# EAGLE schematic Edgecutter (EAGLE 7.7.0)

## Sheet 1 of 6
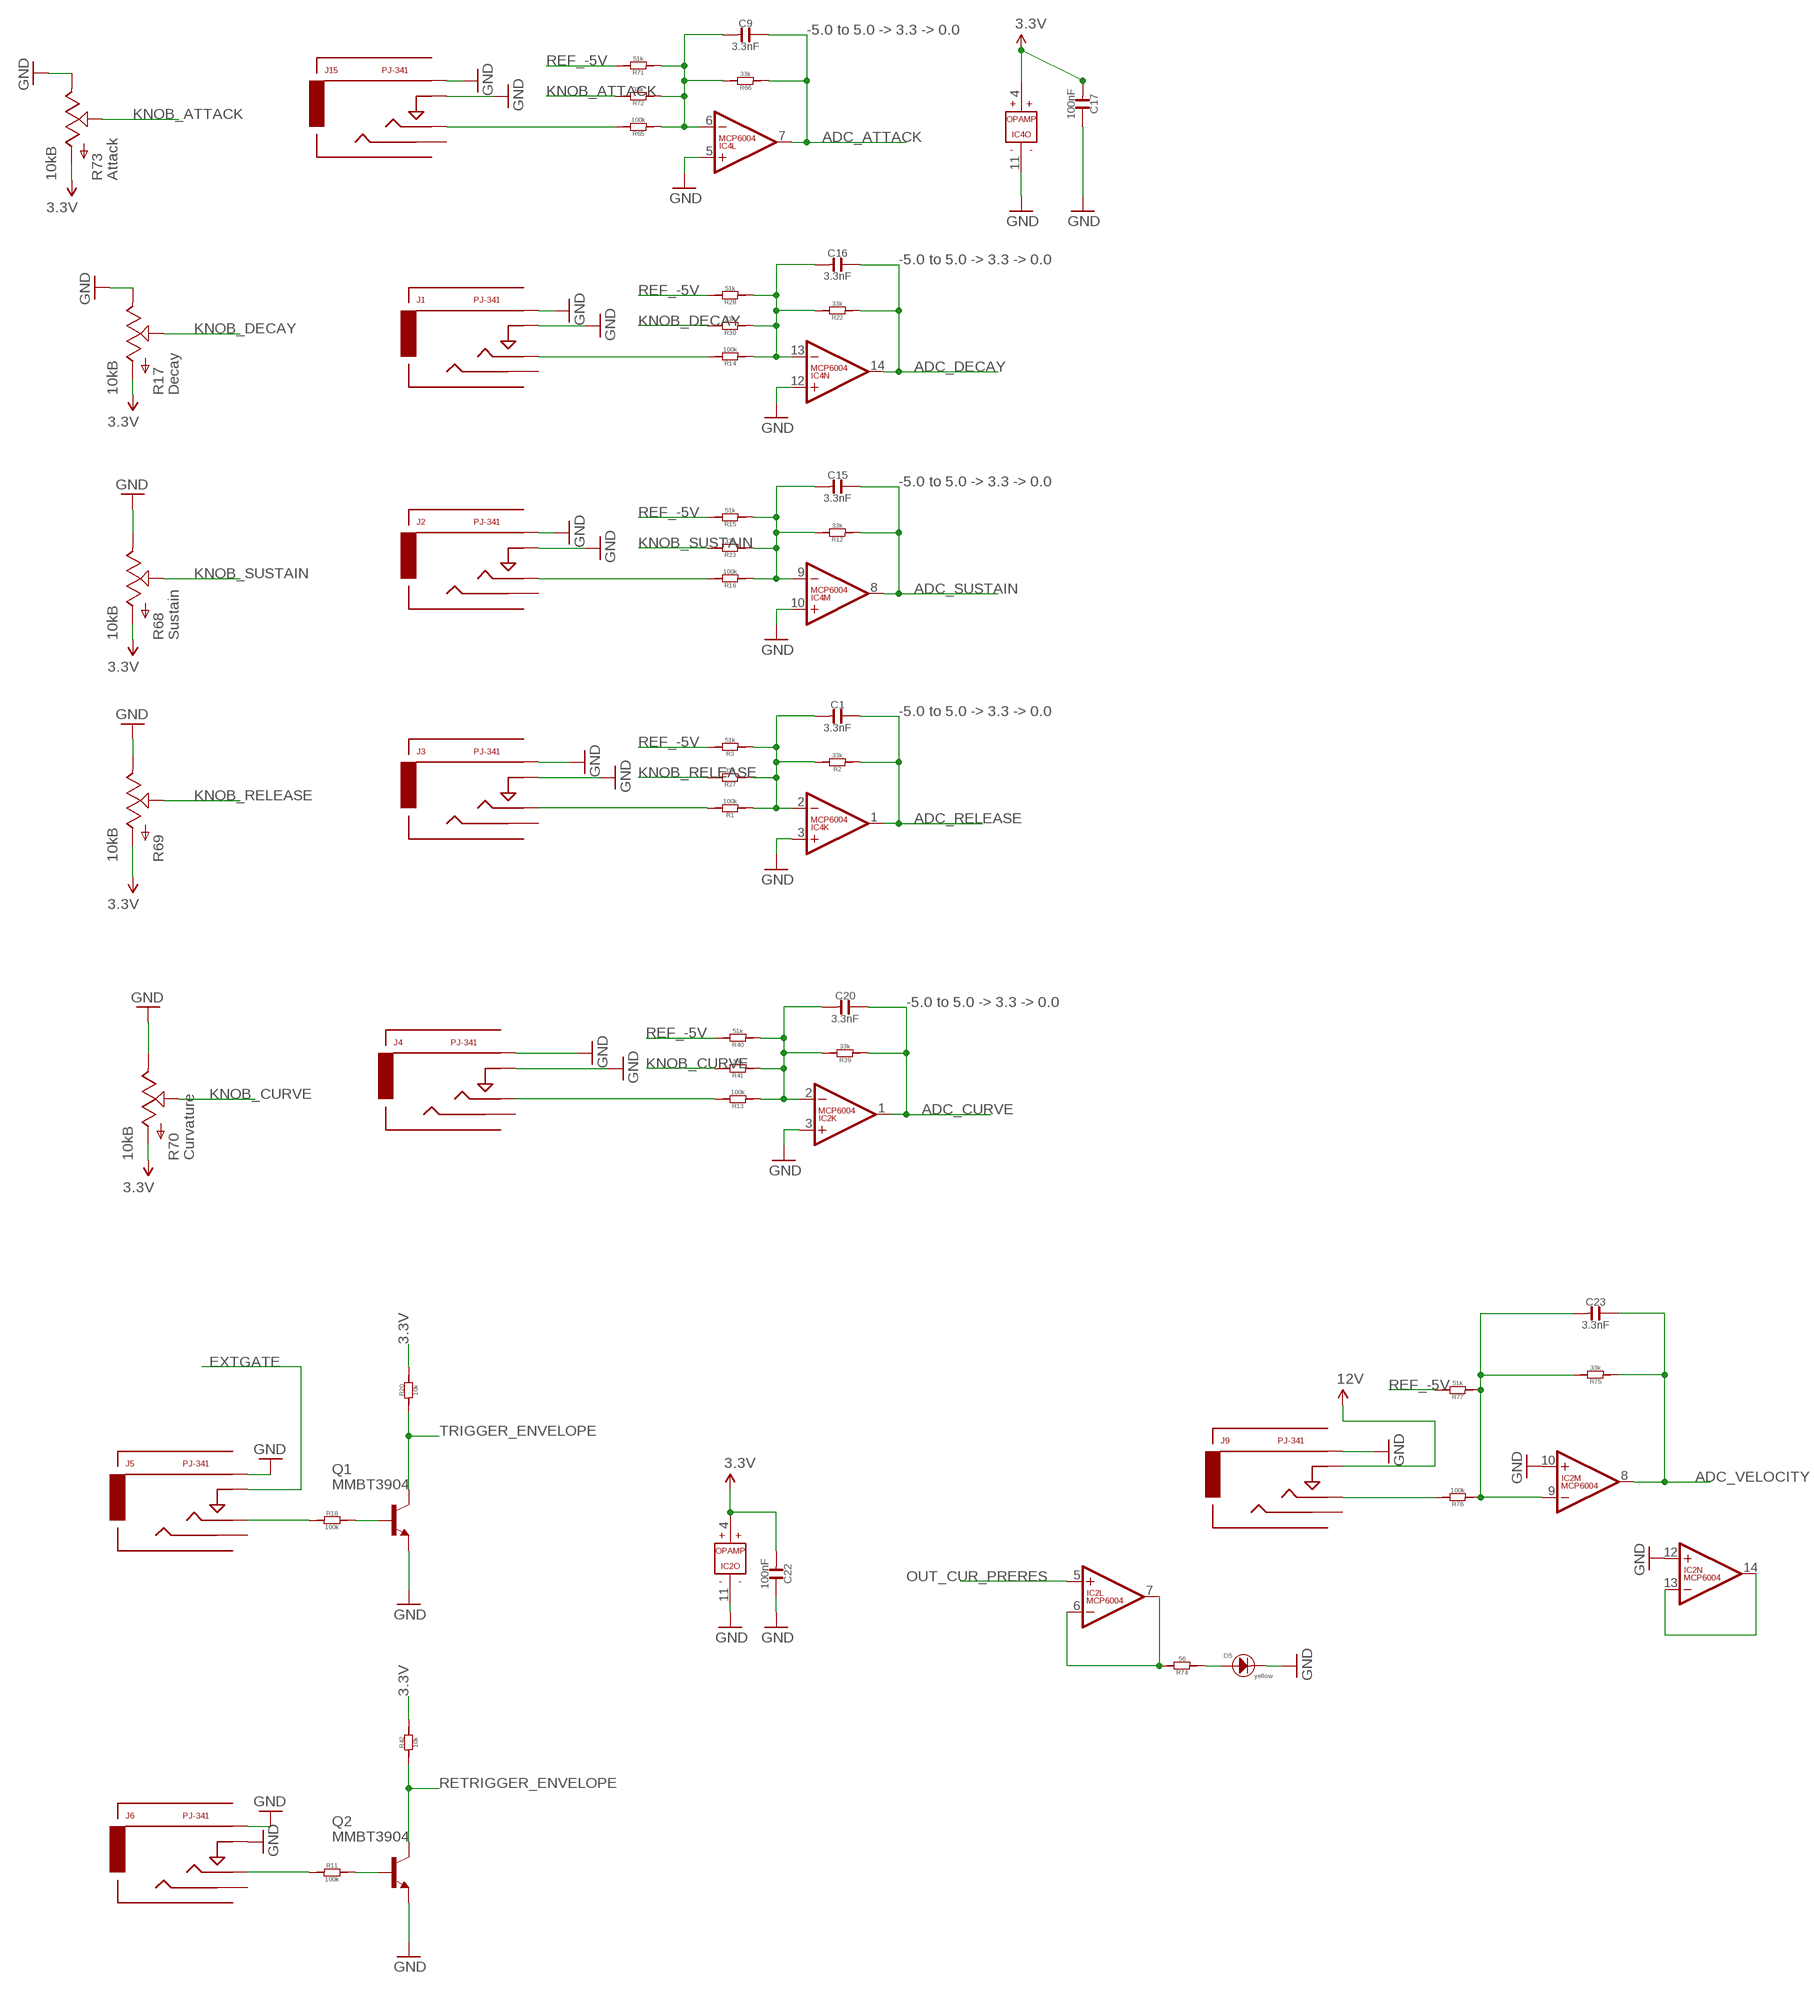
[diagram p0: schematic, sheet 1]

### Parts
C1  3.3nF  C-0603  [C0603]
C9  3.3nF  C-0603  [C0603]
C15  3.3nF  C-0603  [C0603]
C16  3.3nF  C-0603  [C0603]
C17  100nF  C-0603  [C0603]
C20  3.3nF  C-0603  [C0603]
C22  100nF  C-0603  [C0603]
C23  3.3nF  C-0603  [C0603]
D5  yellow  LED3MM  [3MMLED]
IC2  MCP6004  [SO14]
IC4  MCP6004  [SO14]
J1  PJ-341  AUDIO-JACKINPUT  [3.5MM-JACK-SWITCH-13MM-INPUT]
J2  PJ-341  AUDIO-JACKINPUT  [3.5MM-JACK-SWITCH-13MM-INPUT]
J3  PJ-341  AUDIO-JACKINPUT  [3.5MM-JACK-SWITCH-13MM-INPUT]
J4  PJ-341  AUDIO-JACKINPUT  [3.5MM-JACK-SWITCH-13MM-INPUT]
J5  PJ-341  AUDIO-JACKINPUT  [3.5MM-JACK-SWITCH-13MM-INPUT]
J6  PJ-341  AUDIO-JACKINPUT  [3.5MM-JACK-SWITCH-13MM-INPUT]
J9  PJ-341  AUDIO-JACKINPUT  [3.5MM-JACK-SWITCH-13MM-INPUT]
J15  PJ-341  AUDIO-JACKINPUT  [3.5MM-JACK-SWITCH-13MM-INPUT]
Q1  MMBT3904  MMBT3904LT1-NPN-SOT23-BEC  [SOT23-BEC]
Q2  MMBT3904  MMBT3904LT1-NPN-SOT23-BEC  [SOT23-BEC]
R1  100k  R-0603  [R0603]
R2  33k  R-0603  [R0603]
R3  51k  R-0603  [R0603]
R11  100k  R-0603  [R0603]
R12  33k  R-0603  [R0603]
R13  100k  R-0603  [R0603]
R14  100k  R-0603  [R0603]
R15  51k  R-0603  [R0603]
R16  100k  R-0603  [R0603]
R17  10kB  POTZEPHPOT  [OG-POTS_ALPS_POT_VERTICAL]
R18  100k  R-0603  [R0603]
R20  10k  R-0603  [R0603]
R22  33k  R-0603  [R0603]
R23  33k  R-0603  [R0603]
R27  33k  R-0603  [R0603]
R28  51k  R-0603  [R0603]
R30  33k  R-0603  [R0603]
R39  33k  R-0603  [R0603]
R40  51k  R-0603  [R0603]
R41  33k  R-0603  [R0603]
R42  10k  R-0603  [R0603]
R65  100k  R-0603  [R0603]
R66  33k  R-0603  [R0603]
R68  10kB  POTZEPHPOT  [OG-POTS_ALPS_POT_VERTICAL]
R69  10kB  POTZEPHPOT  [OG-POTS_ALPS_POT_VERTICAL]
R70  10kB  POTZEPHPOT  [OG-POTS_ALPS_POT_VERTICAL]
R71  51k  R-0603  [R0603]
R72  33k  R-0603  [R0603]
R73  10kB  POTZEPHPOT  [OG-POTS_ALPS_POT_VERTICAL]
R74  56  R-0603  [R0603]
R75  33k  R-0603  [R0603]
R76  100k  R-0603  [R0603]
R77  51k  R-0603  [R0603]

### Nets
3.3V [mediumpower]: C17.1 C22.1 IC2.4(O:V+) IC4.4(O:V+) R17.P$3(A) R20.2 R42.2 R68.P$3(A) R69.P$3(A) R70.P$3(A) R73.P$3(A) ; also sheet 2,3,4,5,6
12V [heavypower]: J9.SWITCH@3(SWITCH) ; also sheet 3,4,5
ADC_ATTACK: C9.2 IC4.7(L:OUT) R66.1 ; also sheet 6
ADC_CURVE: C20.2 IC2.1(K:OUT) R39.1 ; also sheet 6
ADC_DECAY: C16.2 IC4.14(N:OUT) R22.1 ; also sheet 6
ADC_RELEASE: C1.2 IC4.1(K:OUT) R2.1 ; also sheet 6
ADC_SUSTAIN: C15.2 IC4.8(M:OUT) R12.1 ; also sheet 6
ADC_VELOCITY: C23.2 IC2.8(M:OUT) R75.1 ; also sheet 6
EXTGATE: J5.SWITCH@3(SWITCH) ; also sheet 3
GND [groundplane]: C17.2 C22.2 D5.- IC2.3(K:+IN) IC2.10(M:+IN) IC2.11(O:V-) IC2.12(N:+IN) IC4.3(K:+IN) IC4.5(L:+IN) IC4.10(M:+IN) IC4.11(O:V-) IC4.12(N:+IN) J1.RING@3(RING) J1.SWITCH@3(SWITCH) J2.RING@3(RING) J2.SWITCH@3(SWITCH) J3.RING@3(RING) J3.SWITCH@3(SWITCH) J4.RING@3(RING) J4.SWITCH@3(SWITCH) J5.RING@3(RING) J6.RING@3(RING) J6.SWITCH@3(SWITCH) J9.RING@3(RING) J15.RING@3(RING) J15.SWITCH@3(SWITCH) Q1.E Q2.E R17.P$1(E) R68.P$1(E) R69.P$1(E) R70.P$1(E) R73.P$1(E) ; also sheet 2,3,4,5,6
KNOB_ATTACK: R72.2 R73.P$2(S)
KNOB_CURVE: R41.2 R70.P$2(S)
KNOB_DECAY: R17.P$2(S) R30.2
KNOB_RELEASE: R27.2 R69.P$2(S)
KNOB_SUSTAIN: R23.2 R68.P$2(S)
N$3: J2.TIP@3(TIP) R16.2
N$4: C15.1 IC4.9(M:-IN) R12.2 R15.1 R16.1 R23.1
N$6: J3.TIP@3(TIP) R1.2
N$8: C1.1 IC4.2(K:-IN) R1.1 R2.2 R3.1 R27.1
N$11: J15.TIP@3(TIP) R65.2
N$12: J4.TIP@3(TIP) R13.2
N$15: Q1.B R18.2
N$16: J5.TIP@3(TIP) R18.1
N$19 [groundplane]: IC2.6(L:-IN) IC2.7(L:OUT) R74.2
N$22: C9.1 IC4.6(L:-IN) R65.1 R66.2 R71.1 R72.1
N$26 [groundplane]: IC2.13(N:-IN) IC2.14(N:OUT)
N$33: J1.TIP@3(TIP) R14.2
N$34: C16.1 IC4.13(N:-IN) R14.1 R22.2 R28.1 R30.1
N$43: Q2.B R11.2
N$46: C20.1 IC2.2(K:-IN) R13.1 R39.2 R40.1 R41.1
N$47: J6.TIP@3(TIP) R11.1
N$56: C23.1 IC2.9(M:-IN) R75.2 R76.1 R77.1
N$59: D5.+ R74.1
N$61: J9.TIP@3(TIP) R76.2
OUT_CUR_PRERES: IC2.5(L:+IN) ; also sheet 4
REF_-5V: R3.2 R15.2 R28.2 R40.2 R71.2 R77.2 ; also sheet 3
RETRIGGER_ENVELOPE: Q2.C R42.1 ; also sheet 6
TRIGGER_ENVELOPE: Q1.C R20.1 ; also sheet 6
Unconnected: J1.SECOND@3(SECOND) J2.SECOND@3(SECOND) J3.SECOND@3(SECOND) J4.SECOND@3(SECOND) J5.SECOND@3(SECOND) J6.SECOND@3(SECOND) J9.SECOND@3(SECOND) J15.SECOND@3(SECOND)

### Notes on the sheet
- -5.0 to 5.0 -> 3.3 -> 0.0
- -5.0 to 5.0 -> 3.3 -> 0.0
- -5.0 to 5.0 -> 3.3 -> 0.0
- -5.0 to 5.0 -> 3.3 -> 0.0
- -5.0 to 5.0 -> 3.3 -> 0.0

## Sheet 2 of 6: LEDS and Buttons
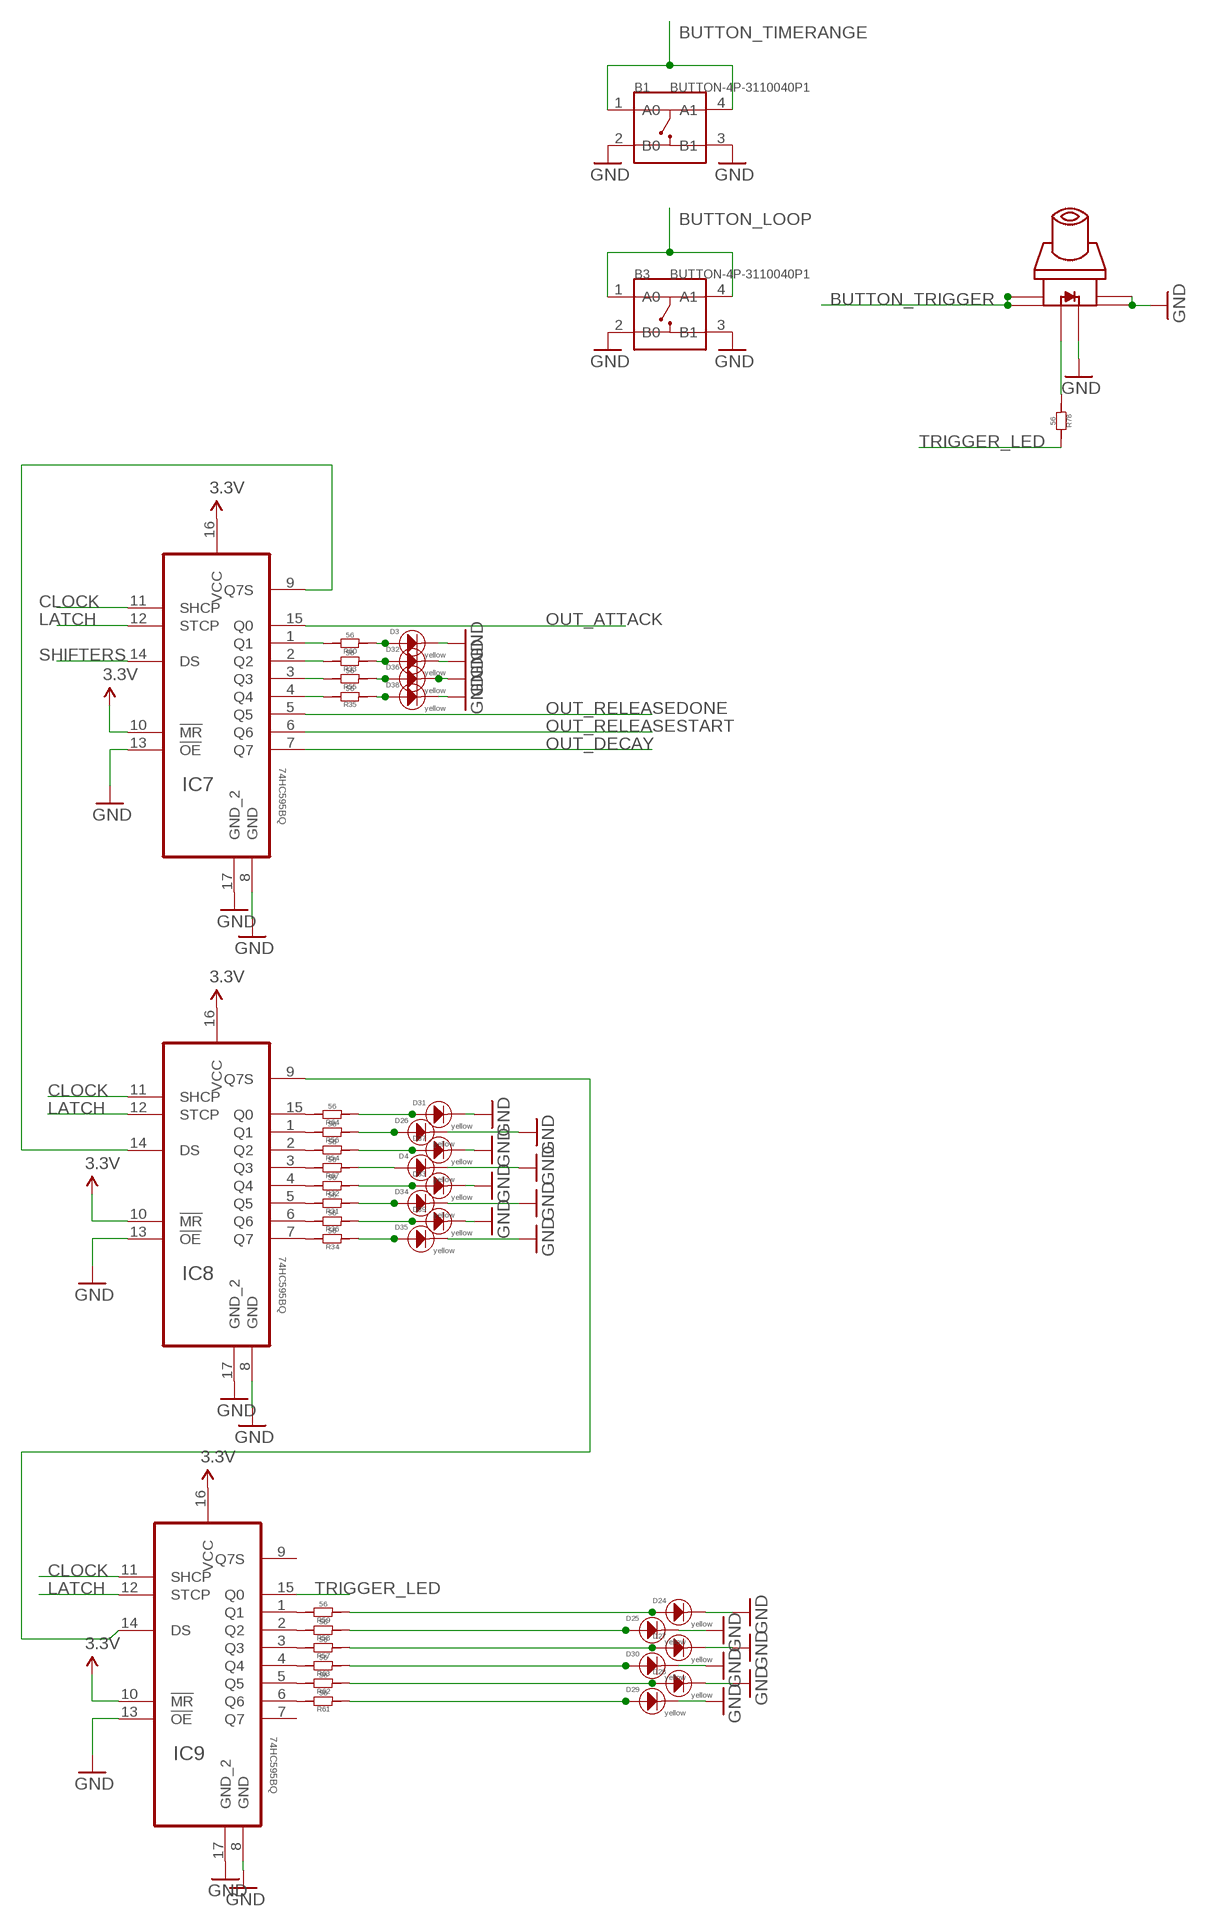
[diagram p1: schematic, sheet 2]

### Parts
B1  BUTTON-4P-3110040P1  [4P-6.0X6.0X5.0H]
B3  BUTTON-4P-3110040P1  [4P-6.0X6.0X5.0H]
D3  yellow  LED3MM  [3MMLED]
D4  yellow  LED3MM  [3MMLED]
D24  yellow  LED3MM  [3MMLED]
D25  yellow  LED3MM  [3MMLED]
D26  yellow  LED3MM  [3MMLED]
D27  yellow  LED3MM  [3MMLED]
D28  yellow  LED3MM  [3MMLED]
D29  yellow  LED3MM  [3MMLED]
D30  yellow  LED3MM  [3MMLED]
D31  yellow  LED3MM  [3MMLED]
D32  yellow  LED3MM  [3MMLED]
D33  yellow  LED3MM  [3MMLED]
D34  yellow  LED3MM  [3MMLED]
D35  yellow  LED3MM  [3MMLED]
D36  yellow  LED3MM  [3MMLED]
D37  yellow  LED3MM  [3MMLED]
D38  yellow  LED3MM  [3MMLED]
D39  yellow  LED3MM  [3MMLED]
IC7  74HC595BQ  [QFN50P250X350X100-17N]
IC8  74HC595BQ  [QFN50P250X350X100-17N]
IC9  74HC595BQ  [QFN50P250X350X100-17N]
R31  56  R-0603  [R0603]
R32  56  R-0603  [R0603]
R33  56  R-0603  [R0603]
R34  56  R-0603  [R0603]
R35  56  R-0603  [R0603]
R36  56  R-0603  [R0603]
R54  56  R-0603  [R0603]
R55  56  R-0603  [R0603]
R56  56  R-0603  [R0603]
R57  56  R-0603  [R0603]
R58  56  R-0603  [R0603]
R59  56  R-0603  [R0603]
R60  56  R-0603  [R0603]
R61  56  R-0603  [R0603]
R62  56  R-0603  [R0603]
R63  56  R-0603  [R0603]
R64  56  R-0603  [R0603]
R67  56  R-0603  [R0603]
R78  56  R-0603  [R0603]
U$2  SWITCH_W_LED_PB6149L-X-102YELLOW  [PB6149L]

### Nets
3.3V [mediumpower]: IC7.10(!MR) IC7.16(VCC) IC8.10(!MR) IC8.16(VCC) IC9.10(!MR) IC9.16(VCC) ; also sheet 1,3,4,5,6
BUTTON_LOOP: B3.1(A0) B3.4(A1) ; also sheet 6
BUTTON_TIMERANGE: B1.1(A0) B1.4(A1) ; also sheet 6
BUTTON_TRIGGER: U$2.1 U$2.2 ; also sheet 6
CLOCK: IC7.11(SHCP) IC8.11(SHCP) IC9.11(SHCP) ; also sheet 6
GND [groundplane]: B1.2(B0) B1.3(B1) B3.2(B0) B3.3(B1) D3.- D4.- D24.- D25.- D26.- D27.- D28.- D29.- D30.- D31.- D32.- D33.- D34.- D35.- D36.- D37.- D38.- D39.- IC7.8(GND) IC7.13(!OE) IC7.17(GND_2) IC8.8(GND) IC8.13(!OE) IC8.17(GND_2) IC9.8(GND) IC9.13(!OE) IC9.17(GND_2) U$2.3 U$2.4 U$2.LEDNEG(NEG) ; also sheet 1,3,4,5,6
LATCH: IC7.12(STCP) IC8.12(STCP) IC9.12(STCP) ; also sheet 6
N$1: R78.1 U$2.LEDPOS(POS)
N$14: IC8.7(Q7) R34.2
N$27: IC8.15(Q0) R64.2
N$28: D28.+ R62.1
N$30: D4.+ R67.1
N$31: IC7.1(Q1) R60.2
N$32: D29.+ R61.1
N$35: IC7.2(Q2) R33.2
N$36: IC7.3(Q3) R55.2
N$37: IC7.4(Q4) R35.2
N$38: IC8.1(Q1) R56.2
N$39: IC8.2(Q2) R54.2
N$40: IC8.3(Q3) R67.2
N$41: IC8.4(Q4) R32.2
N$42: IC8.5(Q5) R31.2
N$48: IC8.6(Q6) R36.2
N$49: IC9.1(Q1) R59.2
N$50: IC9.2(Q2) R58.2
N$51: D3.+ R60.1
N$52: IC9.3(Q3) R57.2
N$53: IC9.4(Q4) R63.2
N$54: IC9.5(Q5) R62.2
N$55: IC9.6(Q6) R61.2
N$73: D27.+ R57.1
N$74: D26.+ R56.1
N$75: D25.+ R58.1
N$76: D24.+ R59.1
N$77: D30.+ R63.1
N$78: D31.+ R64.1
N$79: D32.+ R33.1
N$80: D33.+ R32.1
N$81: D34.+ R31.1
N$82: D35.+ R34.1
N$83: D36.+ R55.1
N$84: D37.+ R54.1
N$85: D38.+ R35.1
N$86: D39.+ R36.1
OUT_ATTACK: IC7.15(Q0) ; also sheet 5
OUT_DECAY: IC7.7(Q7) ; also sheet 5
OUT_RELEASEDONE: IC7.5(Q5) ; also sheet 5
OUT_RELEASESTART: IC7.6(Q6) ; also sheet 5
SHIFTER1TO2: IC7.9(Q7S) IC8.14(DS)
SHIFTER2TO3: IC8.9(Q7S) IC9.14(DS)
SHIFTERS: IC7.14(DS) ; also sheet 6
TRIGGER_LED: IC9.15(Q0) R78.2
Unconnected: IC9.7(Q7) IC9.9(Q7S)

## Sheet 3 of 6: Power
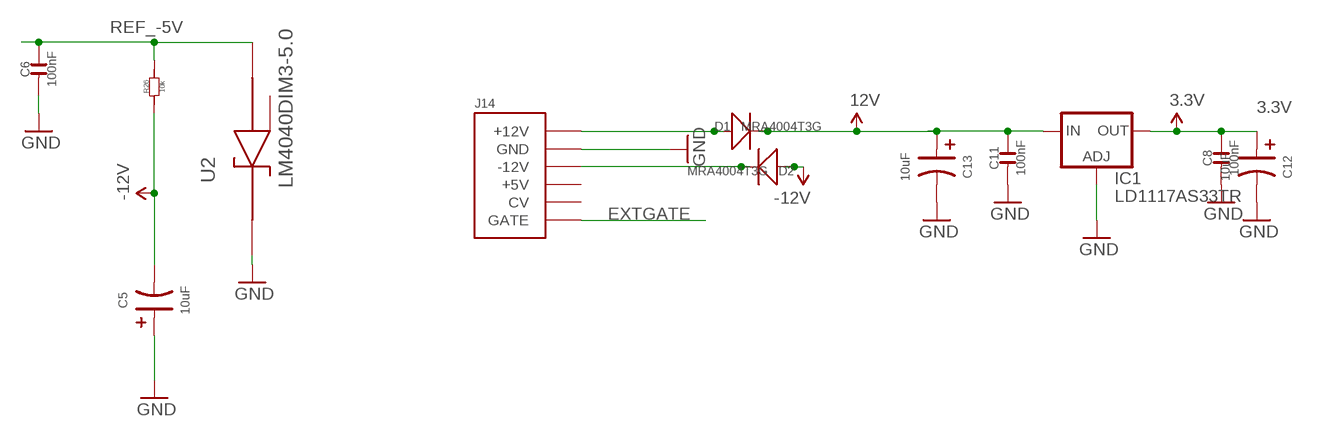
[diagram p2: schematic, sheet 3]

### Parts
C5  10uF  C-POLAR-A  [AVX-A]
C6  100nF  C-0603  [C0603]
C8  100nF  C-0603  [C0603]
C11  100nF  C-0603  [C0603]
C12  10uF  C-POLAR-A  [AVX-A]
C13  10uF  C-POLAR-A  [AVX-A]
D1  MRA4004T3G  D-SMA  [DO-214AC]
D2  MRA4004T3G  D-SMA  [DO-214AC]
IC1  LD1117AS33TR  [SOT223]
J14  POWERSMT  [2X08_SMT_HEADER]
R26  10k  R-0603  [R0603]
U2  LM4040DIM3-5.0  [SOT95P237X112-3N]

### Nets
3.3V [mediumpower]: C8.2 C12.+ IC1.2(OUT) IC1.4(OUT) ; also sheet 1,2,4,5,6
12V [heavypower]: C11.2 C13.+ D1.2(-) IC1.3(IN) ; also sheet 1,4,5
-12V [heavypower]: C5.- D2.1(+) R26.1 ; also sheet 4
EXTGATE: J14.15(GATE) J14.16(GATE) ; also sheet 1
GND [groundplane]: C5.+ C6.1 C8.1 C11.1 C12.- C13.- IC1.1(ADJ) J14.3(GND) J14.4(GND) J14.5(GND) J14.6(GND) J14.7(GND) J14.8(GND) U2.1(CATHODE) ; also sheet 1,2,4,5,6
N$13 [heavypower]: D1.1(+) J14.9(+12V) J14.10(+12V)
N$64 [heavypower]: D2.2(-) J14.1(-12V) J14.2(-12V)
REF_-5V: C6.2 R26.2 U2.2(ANODE) ; also sheet 1
Unconnected: J14.11(+5V) J14.12(+5V) J14.13(CV) J14.14(CV) U2.3(NC)

## Sheet 4 of 6: DAC Output
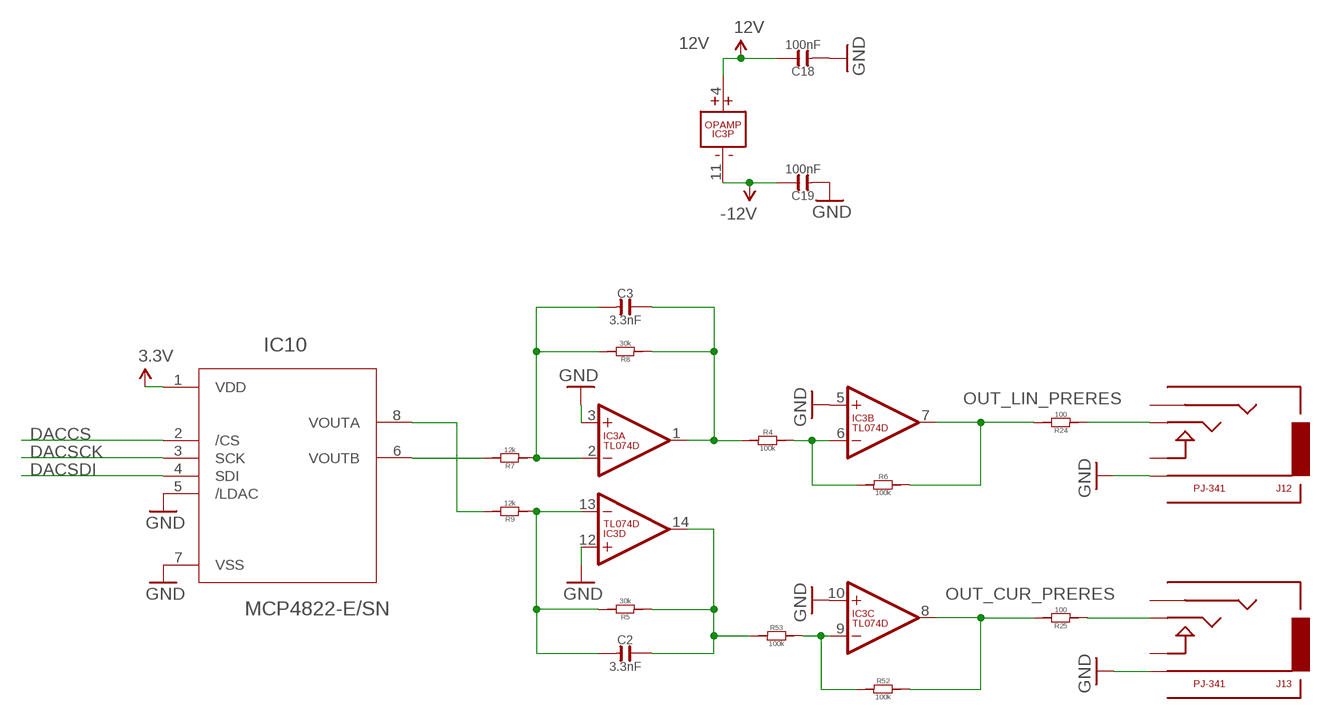
[diagram p3: schematic, sheet 4]

### Parts
C2  3.3nF  C-0603  [C0603]
C3  3.3nF  C-0603  [C0603]
C18  100nF  C-0603  [C0603]
C19  100nF  C-0603  [C0603]
IC3  TL074D  [SO14]
IC10  MCP4822-E/SN  [SOIC8-N_MC]
J12  PJ-341  AUDIO-JACKOUTPUT  [3.5MM-JACK-SWITCH-13MM-OUTPUT]
J13  PJ-341  AUDIO-JACKOUTPUT  [3.5MM-JACK-SWITCH-13MM-OUTPUT]
R4  100k  R-0603  [R0603]
R5  30k  R-0603  [R0603]
R6  100k  R-0603  [R0603]
R7  12k  R-0603  [R0603]
R8  30k  R-0603  [R0603]
R9  12k  R-0603  [R0603]
R24  100  R-0603  [R0603]
R25  100  R-0603  [R0603]
R52  100k  R-0603  [R0603]
R53  100k  R-0603  [R0603]

### Nets
3.3V [mediumpower]: IC10.1(VDD) ; also sheet 1,2,3,5,6
12V [heavypower]: C18.2 IC3.4(P:V+) ; also sheet 1,3,5
-12V [heavypower]: C19.2 IC3.11(P:V-) ; also sheet 3
DACCS: IC10.2(/CS) ; also sheet 6
DACSCK: IC10.3(SCK) ; also sheet 6
DACSDI: IC10.4(SDI) ; also sheet 6
GND [groundplane]: C18.1 C19.1 IC3.3(A:+IN) IC3.5(B:+IN) IC3.10(C:+IN) IC3.12(D:+IN) IC10.5(/LDAC) IC10.7(VSS) J12.RING@3(RING) J13.RING@3(RING) ; also sheet 1,2,3,5,6
N$2: IC3.6(B:-IN) R4.2 R6.1
N$5: IC10.8(VOUTA) R9.2
N$7: IC10.6(VOUTB) R7.2
N$9: C2.1 IC3.13(D:-IN) R5.2 R9.1
N$10: C3.1 IC3.2(A:-IN) R7.1 R8.2
N$17: IC3.9(C:-IN) R52.1 R53.2
N$18: C3.2 IC3.1(A:OUT) R4.1 R8.1
N$20: J13.TIP@3(TIP) R25.1
N$21: J12.TIP@3(TIP) R24.1
N$24: C2.2 IC3.14(D:OUT) R5.1 R53.1
OUT_CUR_PRERES: IC3.8(C:OUT) R25.2 R52.2 ; also sheet 1
OUT_LIN_PRERES: IC3.7(B:OUT) R6.2 R24.2
Unconnected: J12.SECOND@3(SECOND) J12.SWITCH@3(SWITCH) J13.SECOND@3(SECOND) J13.SWITCH@3(SWITCH)

## Sheet 5 of 6: State Outputs
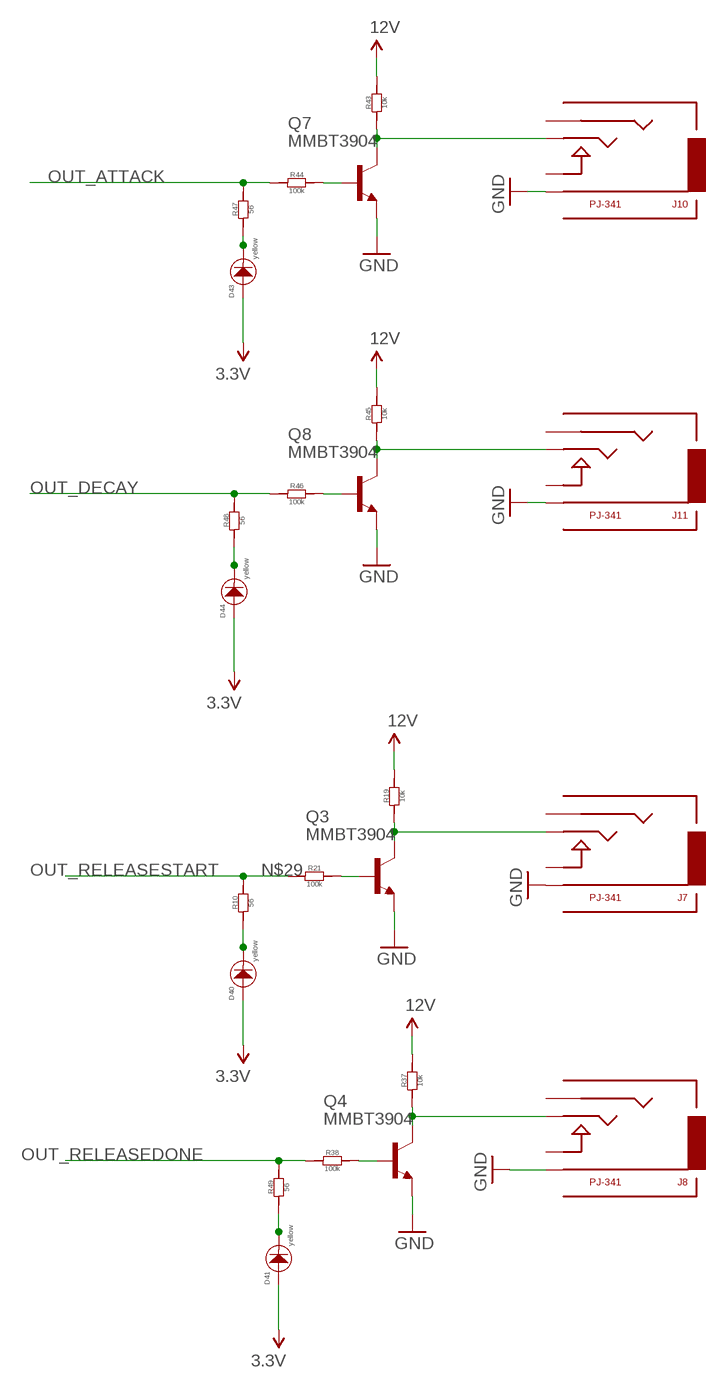
[diagram p4: schematic, sheet 5]

### Parts
D40  yellow  LED3MM  [3MMLED]
D41  yellow  LED3MM  [3MMLED]
D43  yellow  LED3MM  [3MMLED]
D44  yellow  LED3MM  [3MMLED]
J7  PJ-341  AUDIO-JACKOUTPUT  [3.5MM-JACK-SWITCH-13MM-OUTPUT]
J8  PJ-341  AUDIO-JACKOUTPUT  [3.5MM-JACK-SWITCH-13MM-OUTPUT]
J10  PJ-341  AUDIO-JACKOUTPUT  [3.5MM-JACK-SWITCH-13MM-OUTPUT]
J11  PJ-341  AUDIO-JACKOUTPUT  [3.5MM-JACK-SWITCH-13MM-OUTPUT]
Q3  MMBT3904  MMBT3904LT1-NPN-SOT23-BEC  [SOT23-BEC]
Q4  MMBT3904  MMBT3904LT1-NPN-SOT23-BEC  [SOT23-BEC]
Q7  MMBT3904  MMBT3904LT1-NPN-SOT23-BEC  [SOT23-BEC]
Q8  MMBT3904  MMBT3904LT1-NPN-SOT23-BEC  [SOT23-BEC]
R10  56  R-0603  [R0603]
R19  10k  R-0603  [R0603]
R21  100k  R-0603  [R0603]
R37  10k  R-0603  [R0603]
R38  100k  R-0603  [R0603]
R43  10k  R-0603  [R0603]
R44  100k  R-0603  [R0603]
R45  10k  R-0603  [R0603]
R46  100k  R-0603  [R0603]
R47  56  R-0603  [R0603]
R48  56  R-0603  [R0603]
R49  56  R-0603  [R0603]

### Nets
3.3V [mediumpower]: D40.+ D41.+ D43.+ D44.+ ; also sheet 1,2,3,4,6
12V [heavypower]: R19.2 R37.2 R43.2 R45.2 ; also sheet 1,3,4
D21: D43.- R47.1
GND [groundplane]: J7.RING@3(RING) J8.RING@3(RING) J10.RING@3(RING) J11.RING@3(RING) Q3.E Q4.E Q7.E Q8.E ; also sheet 1,2,3,4,6
N$23: D40.- R10.1
N$25: Q3.B R21.2
N$29: J7.TIP@3(TIP) Q3.C R19.1
N$44: D41.- R49.1
N$45: D44.- R48.1
N$57: Q4.B R38.2
N$58: J8.TIP@3(TIP) Q4.C R37.1
N$68: Q7.B R44.2
N$69: J10.TIP@3(TIP) Q7.C R43.1
N$71: Q8.B R46.2
N$72: J11.TIP@3(TIP) Q8.C R45.1
OUT_ATTACK: R44.1 R47.2 ; also sheet 2
OUT_DECAY: R46.1 R48.2 ; also sheet 2
OUT_RELEASEDONE: R38.1 R49.2 ; also sheet 2
OUT_RELEASESTART: R10.2 R21.1 ; also sheet 2
Unconnected: J7.SECOND@3(SECOND) J7.SWITCH@3(SWITCH) J8.SECOND@3(SECOND) J8.SWITCH@3(SWITCH) J10.SECOND@3(SECOND) J10.SWITCH@3(SWITCH) J11.SECOND@3(SECOND) J11.SWITCH@3(SWITCH)

## Sheet 6 of 6: MCU & Eeprom
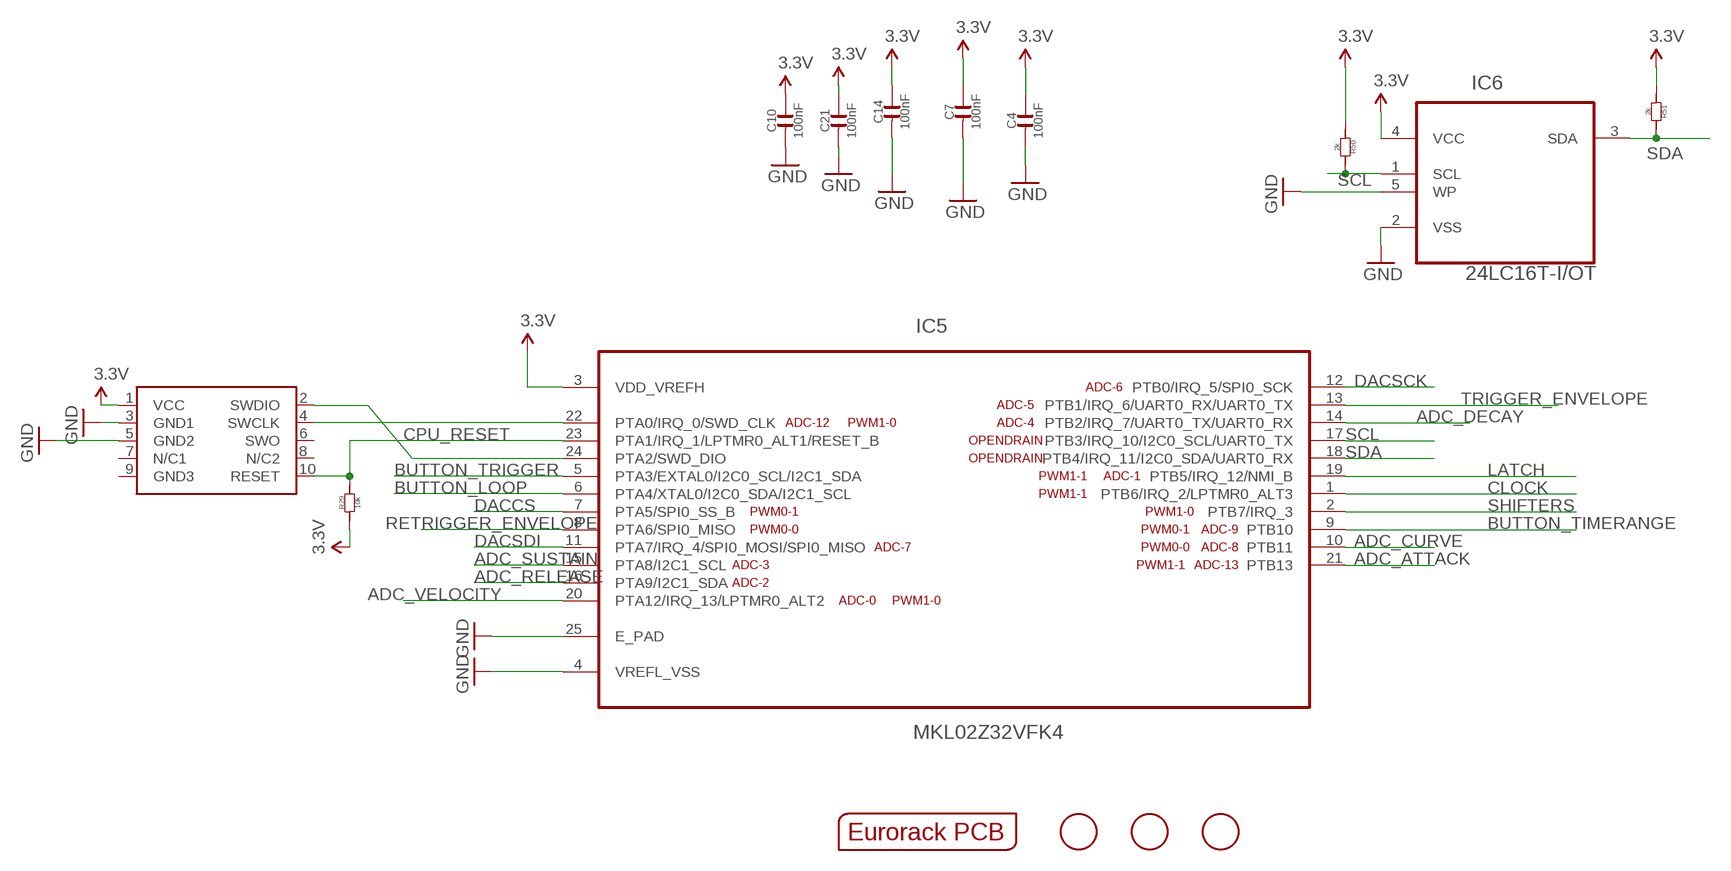
[diagram p5: schematic, sheet 6]

### Parts
C4  100nF  C-0603  [C0603]
C7  100nF  C-0603  [C0603]
C10  100nF  C-0603  [C0603]
C14  100nF  C-0603  [C0603]
C21  100nF  C-0603  [C0603]
FID1  FIDUCIAL  [FIDUCIAL_1MM]
FID2  FIDUCIAL  [FIDUCIAL_1MM]
FID3  FIDUCIAL  [FIDUCIAL_1MM]
IC5  MKL02Z32VFK4  [QFN50P400X400X100-25N]
IC6  24LC16T-I/OT  24LC00T-I/OT  [SOT95P290X145-5N]
OUTLINE  EURORACK_PCB12HP  [EURORACK12HPPCB]
R29  10k  R-0603  [R0603]
R50  2k  R-0603  [R0603]
R51  2k  R-0603  [R0603]
SWD1  CORTEX_SWD  [M50-3600542]

### Nets
3.3V [mediumpower]: C4.2 C7.2 C10.2 C14.2 C21.2 IC5.3(VDD_VREFH) IC6.4(VCC) R29.1 R50.1 R51.1 SWD1.1(VCC) ; also sheet 1,2,3,4,5
ADC_ATTACK: IC5.21(PTB13) ; also sheet 1
ADC_CURVE: IC5.10(PTB11) ; also sheet 1
ADC_DECAY: IC5.14(PTB2/IRQ_7/UART0_TX/UART0_RX) ; also sheet 1
ADC_RELEASE: IC5.16(PTA9/I2C1_SDA) ; also sheet 1
ADC_SUSTAIN: IC5.15(PTA8/I2C1_SCL) ; also sheet 1
ADC_VELOCITY: IC5.20(PTA12/IRQ_13/LPTMR0_ALT2) ; also sheet 1
BUTTON_LOOP: IC5.6(PTA4/XTAL0/I2C0_SDA/I2C1_SCL) ; also sheet 2
BUTTON_TIMERANGE: IC5.9(PTB10) ; also sheet 2
BUTTON_TRIGGER: IC5.5(PTA3/EXTAL0/I2C0_SCL/I2C1_SDA) ; also sheet 2
CLOCK: IC5.1(PTB6/IRQ_2/LPTMR0_ALT3) ; also sheet 2
CPU_RESET: IC5.23(PTA1/IRQ_1/LPTMR0_ALT1/RESET_B) R29.2 SWD1.10(RESET)
DACCS: IC5.7(PTA5/SPI0_SS_B) ; also sheet 4
DACSCK: IC5.12(PTB0/IRQ_5/SPI0_SCK) ; also sheet 4
DACSDI: IC5.11(PTA7/IRQ_4/SPI0_MOSI/SPI0_MISO) ; also sheet 4
GND [groundplane]: C4.1 C7.1 C10.1 C14.1 C21.1 IC5.4(VREFL_VSS) IC5.25(E_PAD) IC6.2(VSS) IC6.5(WP) SWD1.3(GND1) SWD1.5(GND2) ; also sheet 1,2,3,4,5
LATCH: IC5.19(PTB5/IRQ_12/NMI_B) ; also sheet 2
RETRIGGER_ENVELOPE: IC5.8(PTA6/SPI0_MISO) ; also sheet 1
SCL: IC5.17(PTB3/IRQ_10/I2C0_SCL/UART0_TX) IC6.1(SCL) R50.2
SDA: IC5.18(PTB4/IRQ_11/I2C0_SDA/UART0_RX) IC6.3(SDA) R51.2
SHIFTERS: IC5.2(PTB7/IRQ_3) ; also sheet 2
SWD_CLK: IC5.22(PTA0/IRQ_0/SWD_CLK) SWD1.4(SWCLK)
SWD_DIO: IC5.24(PTA2/SWD_DIO) SWD1.2(SWDIO)
TRIGGER_ENVELOPE: IC5.13(PTB1/IRQ_6/UART0_RX/UART0_TX) ; also sheet 1
Unconnected: SWD1.6(SWO) SWD1.7(N/C1) SWD1.8(N/C2) SWD1.9(GND3)

## Library data of the parts
B1 B3 = zephod-components:BUTTON-4P; OC_FARNELL: unknown
C1-C3 C9 C15 C16 C20 C23 = OPL:C*; OC_FARNELL: unknown
C4 C7 C8 C10 C11 C14 C17-C19 C21 C22 = OPL:C*; MF: MULTICOMP; MPN: MC0603F104Z160CT; OC_FARNELL: 1759017
C5 C12 C13 = EurorackModularParts:C-POLAR*; MF: AVX; MPN: TAJB106K020RNJ; OC_FARNELL: 197427
C6 = OPL:C*; MF: AVX; MPN: 06035C104KAT2A; OC_FARNELL: 1301804
D1 D2 = OPL:D*: DIODE; MF: VISHAY; MPN: US1G-E3/5AT; OC_FARNELL: 9551824
D3-D5 D24-D41 D43 D44 = EurorackModularParts:LED*: LED
FID1-FID3 = adafruit:FIDUCIAL: For use by pick and place machines to calibrate the vision/machine, 1mm By microbuilder.eu; OC_FARNELL: unknown
IC1 = ld-components:LD1117A?*: Low drop fixed and adjustable positive voltage regulators 1 A Source: http://www.st.com/stonline/products/literature/ds/7194/ld1117axx.pdf; MF: STMICROELECTRONICS; MPN: LD1117AS33TR; OC_FARNELL: 1467776
IC2 IC4 = EurorackModularParts:MCP6004; MF: MICROCHIP; MPN: MCP6004-I/SL.; OC_FARNELL: 1605572
IC3 = EurorackModularParts:TL074: OP AMP; MF: TEXAS INSTRUMENTS; MPN: TL074CD; OC_FARNELL: 1103010
IC5 = FarnellThings:MKL02Z32VFK4: IC, MCU, 32BIT, CORTEX M0+, 48MHZ, QFN-24; MF: NXP; MPN: MKL02Z32VFK4; OC_FARNELL: 2321481; OC_NEWARK: 61W9887; PACKAGE: QFN-24; SUPPLIER: FREESCALE SEMICONDUCTOR
IC6 = EurorackModularParts:24LC00T-I/OT: IC, EEPROM 128BIT SERIAL 400KHZ SOT-23-5; MF: MICROCHIP; MPN: 24LC16T-I/OT; OC_FARNELL: 9757864; OC_NEWARK: 62K0574; PACKAGE: SOT-23-5; SUPPLIER: MICROCHIP
IC7-IC9 = FarnellThings:74HC595BQ: 8-bit serial-in, serial or parallel-out shift register,QFN-16; MF: NXP; MPN: 74HC595BQ; OC_FARNELL: 2164850; OC_NEWARK: 43W8000; PACKAGE: QFN-16; SUPPLIER: NXP
IC10 = FarnellThings:MCP4822-E/SN: 12 Bit DAC; DESCRIPTION: 12 Bit DAC; MF: MICROCHIP; MPN: MCP4822-E/SN; OC_FARNELL: 1439414; OC_NEWARK: 31K2975; PACKAGE: SOIC-8; SUPPLIER: Microchip
J1 = EurorackModularParts:AUDIO-JACK: Switching Mono 3.5mm Audio Jack from Erthenvar.; DESC: Decay; OC_FARNELL: unknown
J2 = EurorackModularParts:AUDIO-JACK: Switching Mono 3.5mm Audio Jack from Erthenvar.; DESC: Sustain; OC_FARNELL: unknown
J3 = EurorackModularParts:AUDIO-JACK: Switching Mono 3.5mm Audio Jack from Erthenvar.; DESC: Release; OC_FARNELL: unknown
J4 = EurorackModularParts:AUDIO-JACK: Switching Mono 3.5mm Audio Jack from Erthenvar.; DESC: Curvature; OC_FARNELL: unknown
J5 = EurorackModularParts:AUDIO-JACK: Switching Mono 3.5mm Audio Jack from Erthenvar.; DESC: Gate; OC_FARNELL: unknown
J6 = EurorackModularParts:AUDIO-JACK: Switching Mono 3.5mm Audio Jack from Erthenvar.; DESC: Retrigger; OC_FARNELL: unknown
J7 = EurorackModularParts:AUDIO-JACK: Switching Mono 3.5mm Audio Jack from Erthenvar.; DESC: ReleaseStartTrigger; OC_FARNELL: unknown
J8 = EurorackModularParts:AUDIO-JACK: Switching Mono 3.5mm Audio Jack from Erthenvar.; DESC: ReleaseDoneTrigger; OC_FARNELL: unknown
J9 = EurorackModularParts:AUDIO-JACK: Switching Mono 3.5mm Audio Jack from Erthenvar.; DESC: Velocity; OC_FARNELL: unknown
J10 = EurorackModularParts:AUDIO-JACK: Switching Mono 3.5mm Audio Jack from Erthenvar.; DESC: AttackTrigger; OC_FARNELL: unknown
J11 = EurorackModularParts:AUDIO-JACK: Switching Mono 3.5mm Audio Jack from Erthenvar.; DESC: DecayTrigger; OC_FARNELL: unknown
J12 = EurorackModularParts:AUDIO-JACK: Switching Mono 3.5mm Audio Jack from Erthenvar.; DESC: Linear; OC_FARNELL: unknown
J13 = EurorackModularParts:AUDIO-JACK: Switching Mono 3.5mm Audio Jack from Erthenvar.; DESC: Curved; OC_FARNELL: unknown
J14 = EurorackModularParts:POWER; OC_FARNELL: unknown
J15 = EurorackModularParts:AUDIO-JACK: Switching Mono 3.5mm Audio Jack from Erthenvar.; DESC: Attack; OC_FARNELL: unknown
OUTLINE = EurorackModularParts:EURORACK_PCB; OC_FARNELL: unknown
Q1-Q4 Q7 Q8 = transistor:*-NPN-: NPN Transistror BF959 corrected 2008.03.06; MF: NXP; MPN: PMBT3904,215; OC_FARNELL: 2336795
R1-R16 R18-R67 R71 R72 R74-R78 = OPL:R*; OC_FARNELL: unknown
R17 = EurorackModularParts:POT; DESC: Decay; OC_FARNELL: unknown
R68 = EurorackModularParts:POT; DESC: Sustain; OC_FARNELL: unknown
R69 = EurorackModularParts:POT; DESC: Release; OC_FARNELL: unknown
R70 = EurorackModularParts:POT; DESC: Curvature; OC_FARNELL: unknown
R73 = EurorackModularParts:POT; DESC: Attack; OC_FARNELL: unknown
SWD1 = carrilib with jtags:CORTEX_SWD: .05" Cortex M Connector in SWD mode Manufacturer: Generic Part Number: Cortex M SWD Notes: I use Harwin M50-3600542 connectors; OC_FARNELL: unknown
U2 = FarnellThings:LM4040DIM3-5.0: IC, Precision Micropower Shunt Voltage Reference, 5V,SOT-23-3; MF: TEXAS INSTRUMENTS; MPN: LM4040DIM3-5.0; OC_FARNELL: 9778330; OC_NEWARK: 97K3489; PACKAGE: SOT-23-3; SUPPLIER: TEXAS INSTRUMENTS
U$2 = zephod-components:SWITCH_W_LED_PB6149L-X-102

## Net classes
0 default: width 0.203 mm, clearance 0.178 mm
1 heavypower: width 0.381 mm
2 mediumpower: width 0.254 mm
3 groundplane: width 0.178 mm, clearance 0.178 mm